# EAGLE board MicroMod_Asset_Tracker (EAGLE 9.6.2), part 1 of 2
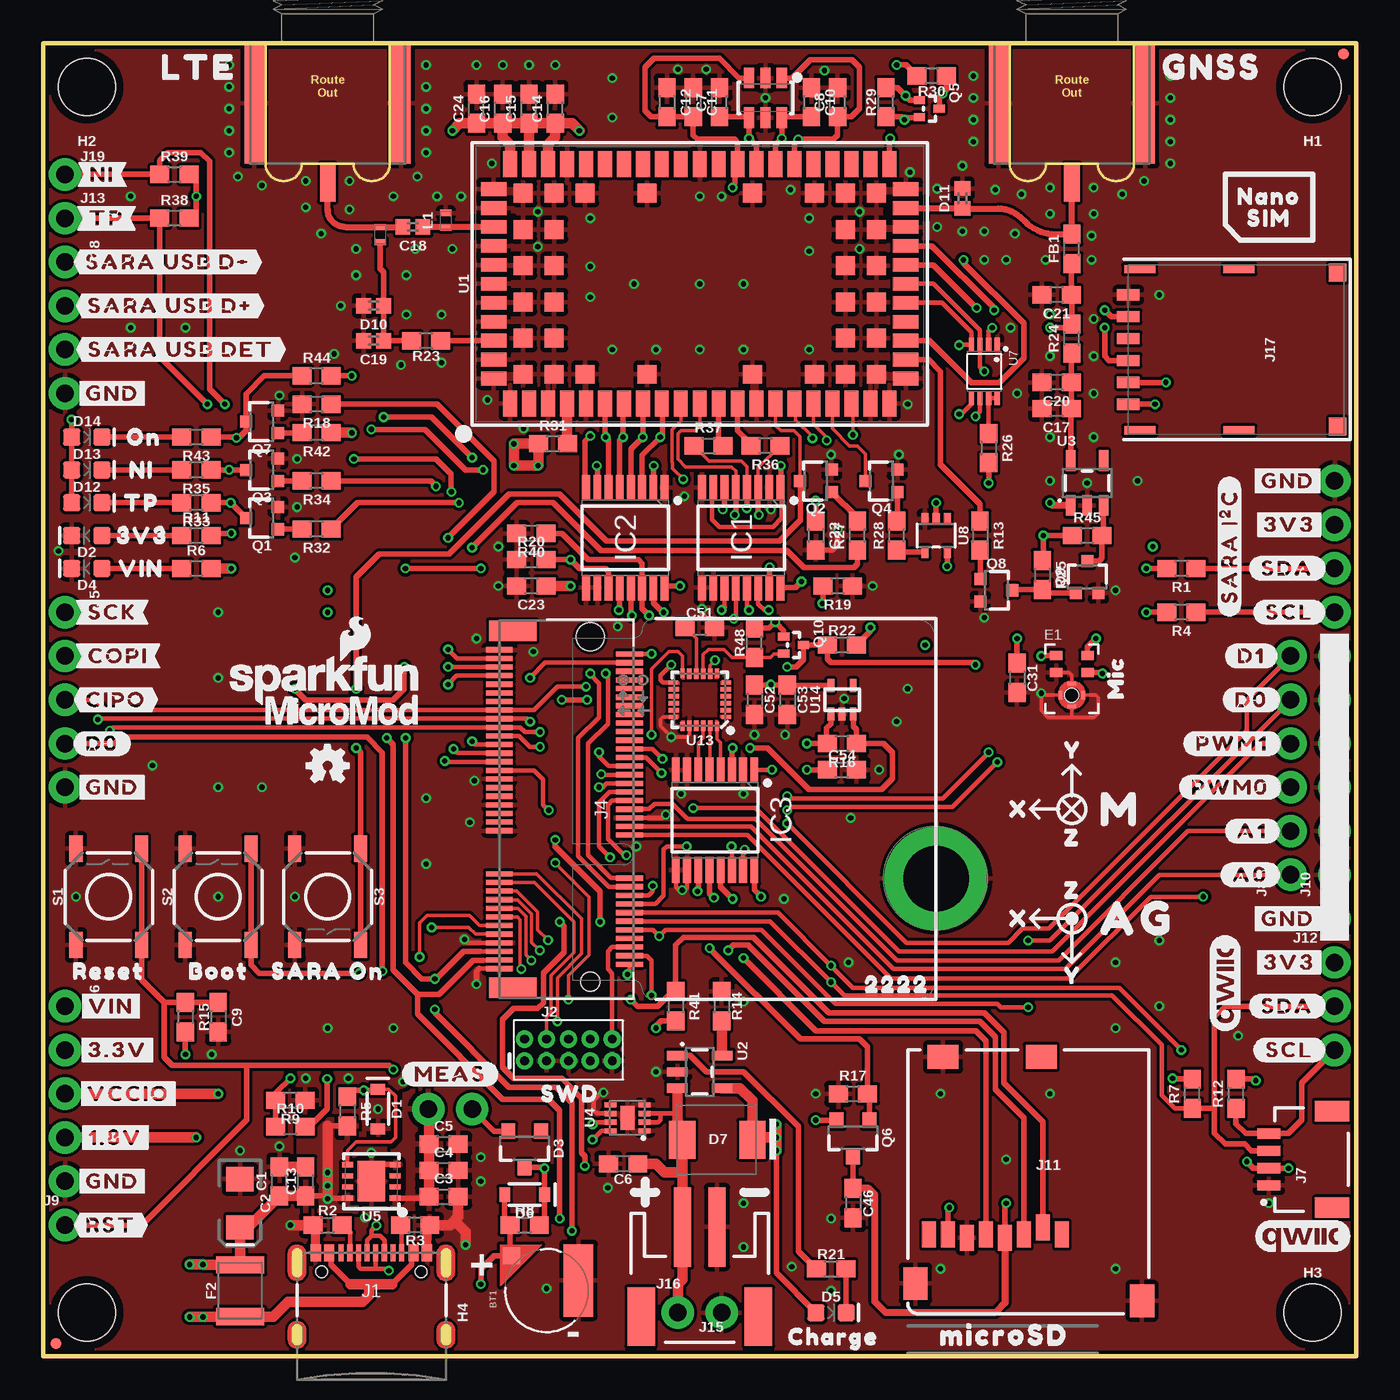
[diagram p2: board, top side]
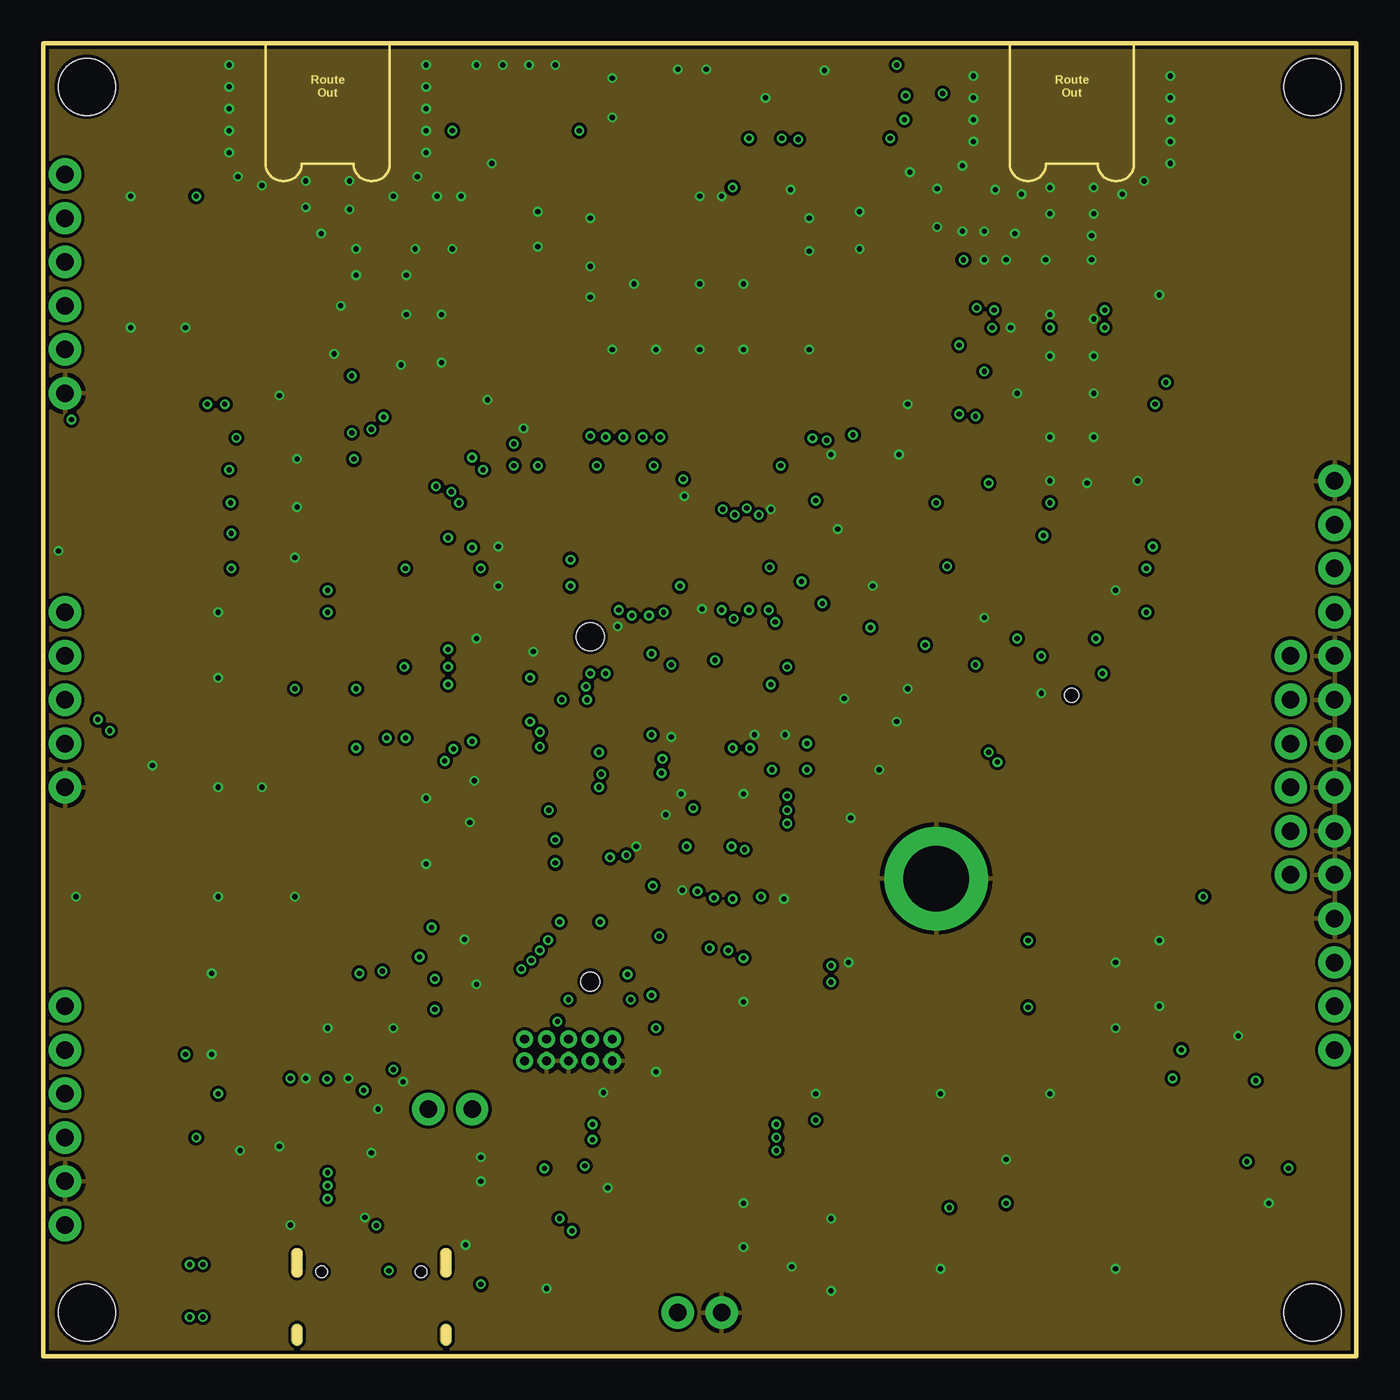
[diagram p3: board, inner layer Route2]
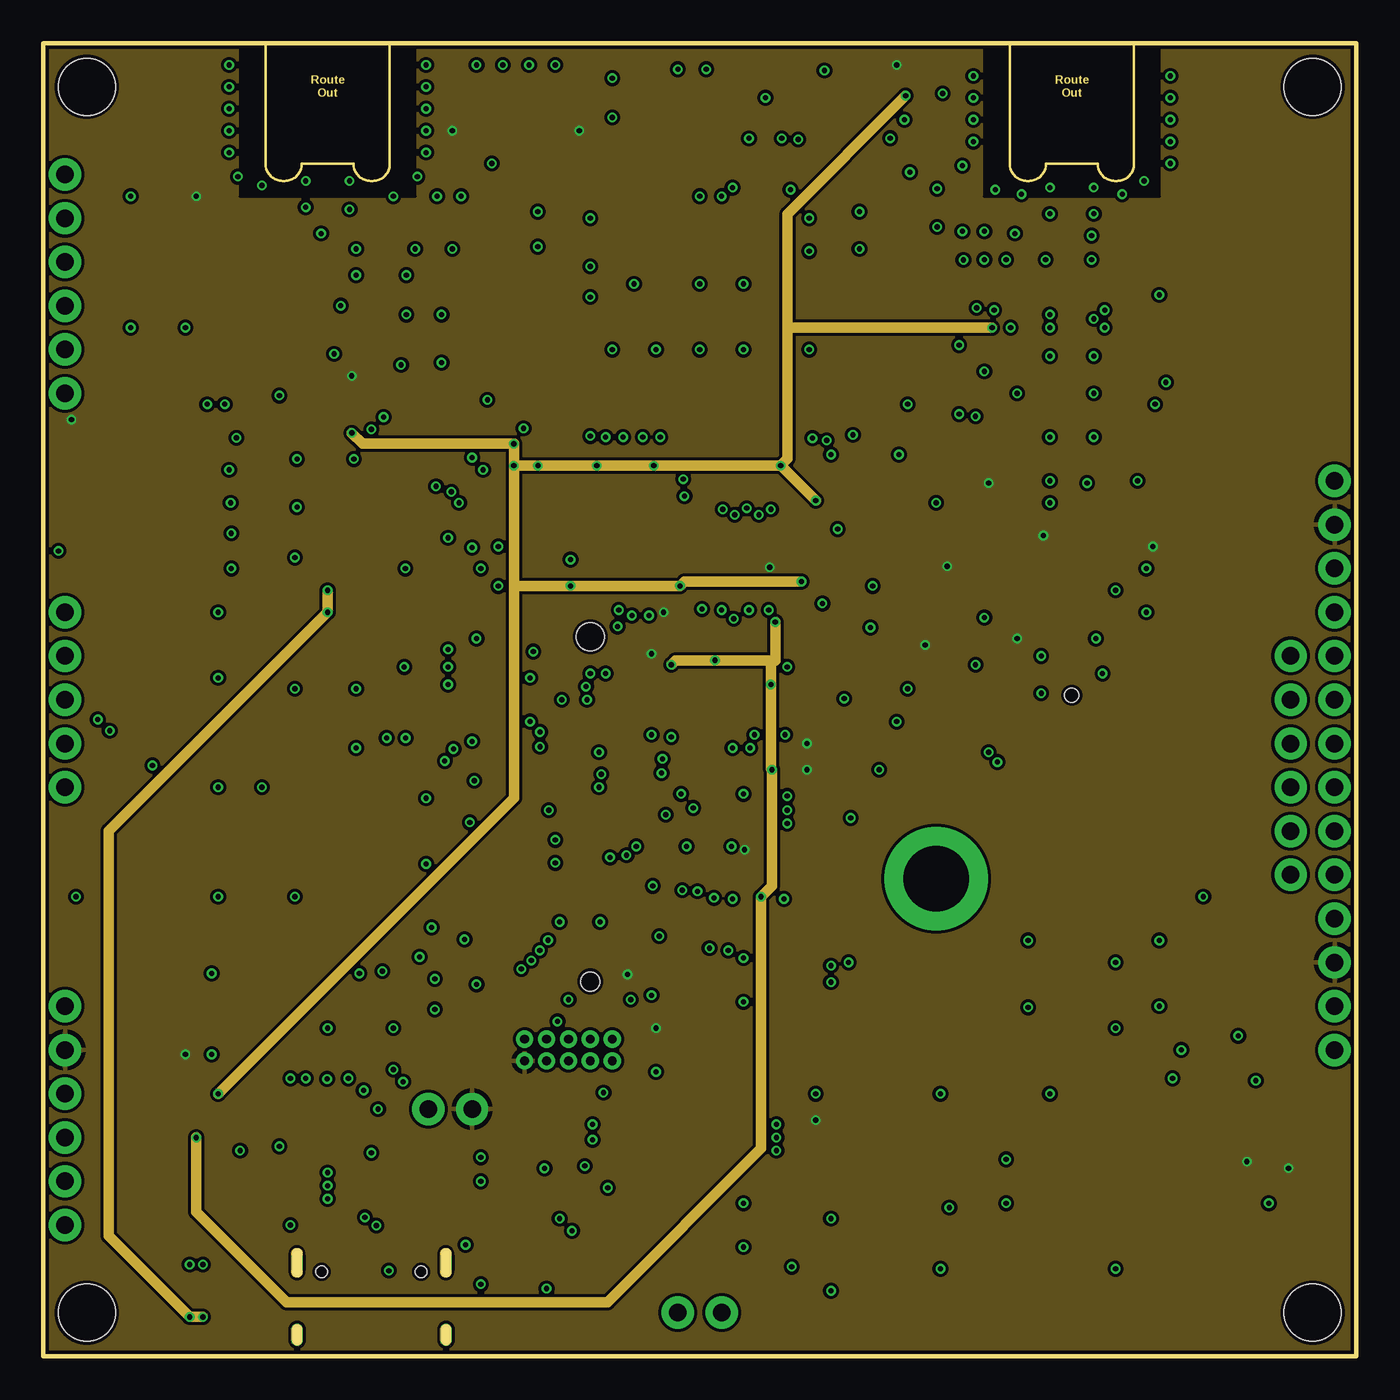
[diagram p4: board, inner layer Route15]
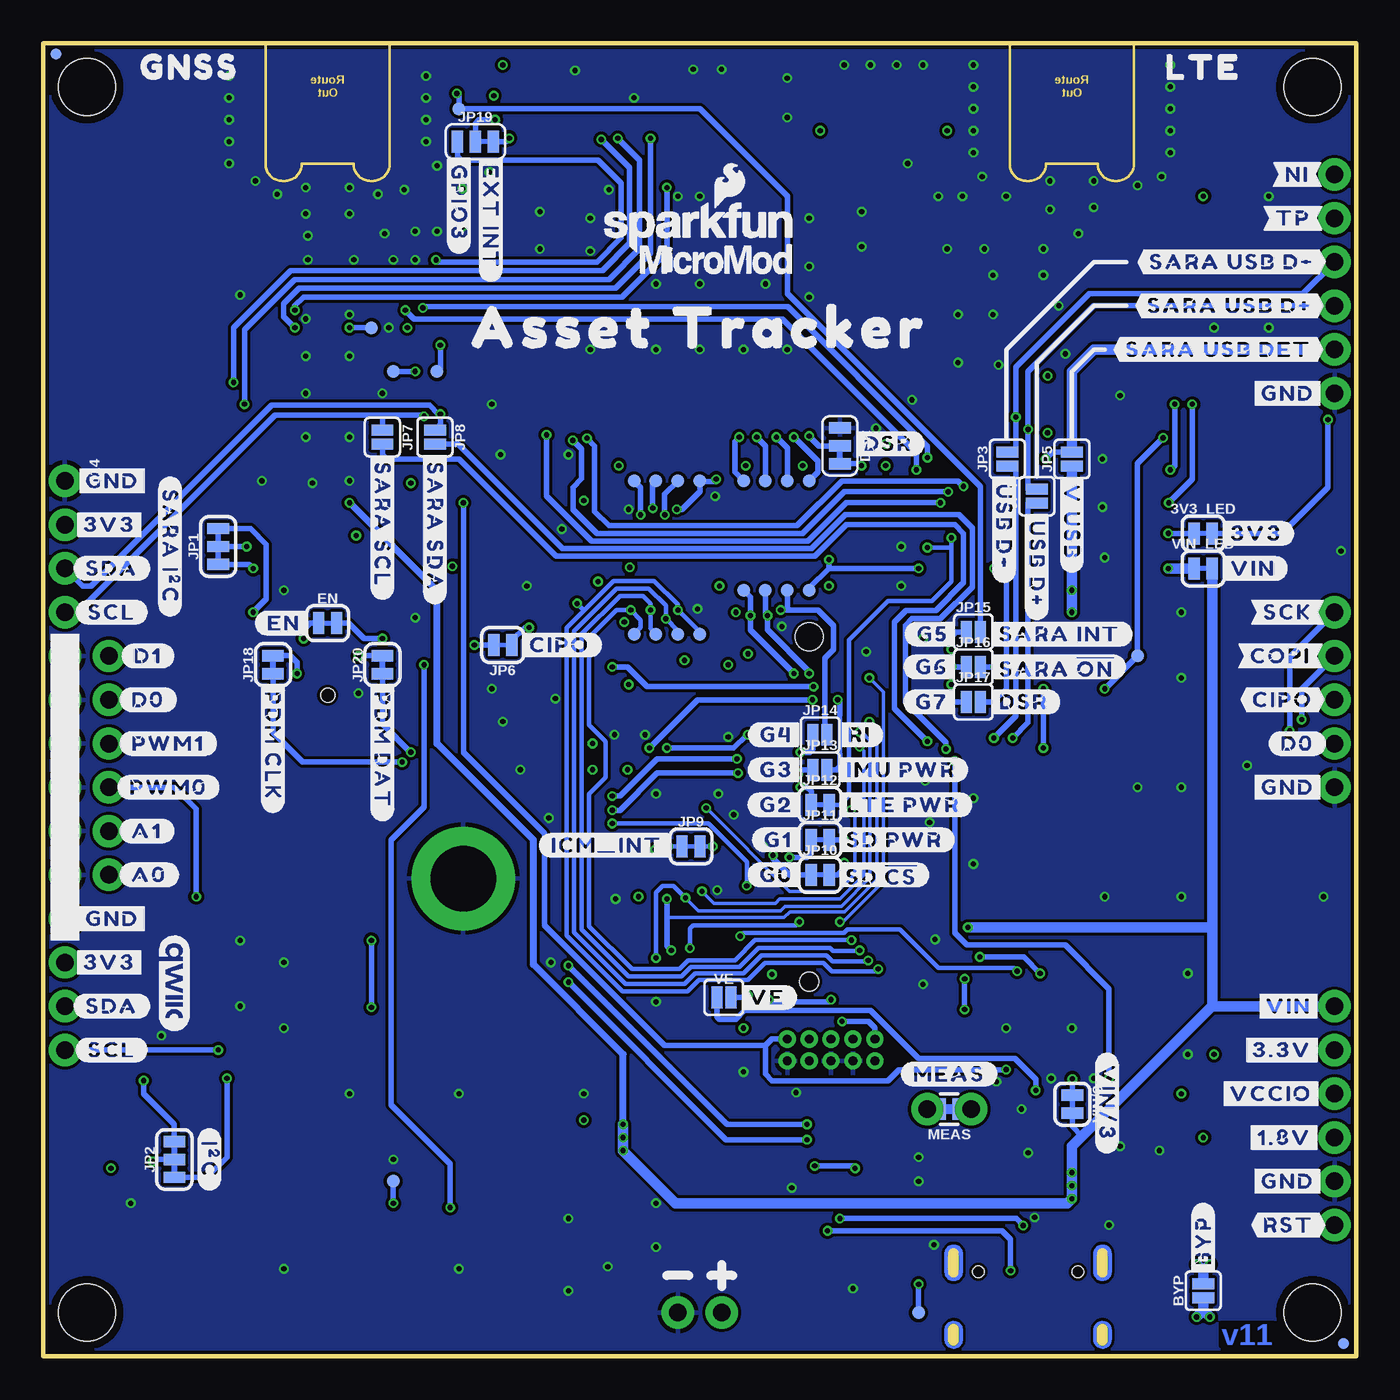
[diagram p5: board, bottom side, seen from below]

Size 76.2 x 76.2 mm. Coordinates in mm from the lower left corner, seen from the top.
Outline: 0,0 0,76.2 76.2,76.2 76.2,0 0,0
Copper layers (1+2*15+16): Top 0.035mm / dielectric 0.2mm / Route2 0.0175mm / dielectric 1.065mm / Route15 0.0175mm / dielectric 0.2mm / Bottom 0.035mm
Design rules "SparkFun-4-layer-1oz-JLCPCB": minimum track width 5mil, minimum drill 0.2mm, track to track 5mil, track to pad 0.2mm, pad to pad 5mil, via to via 0.2mm, smd to smd 0mil, copper to edge 0.2mm, drill to drill 10mil, minimum pad ring 0.13mm, minimum via ring 0.13mm, stop-mask expansion 0.05mm, vias tented up to drill 25mil, thermal gap 10mil
Net classes: 0 default: width 0 mm, drill 0 mm; 1 power: width 0.762 mm

## Footprints (pad centres in the part's own frame; a part is rotated, then mirrored left to right if it is on the bottom)
SMT-JUMPER_2_NC_TRACE_SILK = smd 0.66 x 1.27: 1 -0.521,0; 2 0.521,0
ML414H_IV01E = smd 1 x 1: + 2.022,2.032 | smd 4.2 x 1.7: - 0.6,-1.85
SMT-JUMPER_2_NO_SILK = smd 0.635 x 1.27: 1 -0.406,0; 2 0.406,0
0603 = smd 1.1 x 1: 1 -0.85,0; 2 0.85,0
EIA3216 = smd 1.4 x 1.6: + 1.4,0; - -1.4,0
0402 = smd 0.85 x 0.9: 1 -0.58,0; 2 0.58,0
SOD-323 = smd 0.63 x 0.83: A 1.15,0; C -1.15,0
LED-0603 = smd 1 x 1: A -0.877,0; C 0.877,0
SOT23-3 = smd 0.8 x 0.9: 1 -0.95,-1; 2 0.95,-1; 3 0,1.1
DO-214BA = smd 1.52 x 2.21: A -2.032,0; C 2.038,0
SOT23-6L = smd 0.6 x 1.2: 1 -0.95,-1.15; 2 0,-1.15; 3 0.95,-1.15; 4 0.95,1.15; 5 0,1.15; 6 -0.95,1.15
SMT-JUMPER_3_1-NC_TRACE_SILK = smd 0.66 x 1.27: 1 -1.041,0; 2 0,0; 3 1.041,0
SPH0641LM4H-1_MICROPHONE = smd 0.725 x 0.522: 1 -0.9,1.3; 2 -0.9,0.3; 4 0.9,0.3; 5 0.9,1.3 | smd 0.5 x 0.2: 3 0,-1.65; 8 0,-0.35 | smd 0.2 x 0.5: 6 -0.65,-1; 7 0.65,-1 | hole 0.8: 0,-1
SMA-EDGE-SMD = smd 1.15 x 7: GND@0 -4.25,-3.5; GND@1 4.25,-3.5 | smd 0.9 x 2.2: SIG 0,-8.1
1210 = smd 1 x 2.8: 1 -1.5,0; 2 1.5,0
FIDUCIAL-MICRO = smd 0.635 x 0.635: 1 0,0
STAND-OFF = hole 3.302: 0,0
STAND-OFF-REFLOW-M2.5 = drill 3.8 pad 6: 1 0,0
SOP65P640X120-16N = smd 1.5 x 0.45: 1 -2.9,2.275; 2 -2.9,1.625; 3 -2.9,0.975; 4 -2.9,0.325; 5 -2.9,-0.325; 6 -2.9,-0.975; 7 -2.9,-1.625; 8 -2.9,-2.275; 9 2.9,-2.275; 10 2.9,-1.625; 11 2.9,-0.975; 12 2.9,-0.325; 13 2.9,0.325; 14 2.9,0.975; 15 2.9,1.625; 16 2.9,2.275
USB-C-16P_4LAYER-PADS = smd 0.3 x 1: A5 -1.25,-0.34; A6 -0.25,-0.34; A7 0.25,-0.34; A8 1.25,-0.34; B5 1.75,-0.34; B6 0.75,-0.34; B7 -0.75,-0.34; B8 -1.75,-0.34 | smd 0.6 x 1: GND -3.225,-0.34; GND2 3.225,-0.34; VBUS1 -2.45,-0.34; VBUS2 2.45,-0.34 | drill 0.4 pad 0.6 long: SHLD1 -4.318,-0.915; SHLD2 4.318,-0.915; SHLD3 -4.318,-5.095; SHLD4 4.318,-5.095 | hole 0.65: -2.89,-1.445; 2.89,-1.445
2X5-PTH-1.27MM = drill 0.508 pad 1: 1 -2.54,-0.635; 2 -2.54,0.635; 3 -1.27,-0.635; 4 -1.27,0.635; 5 0,-0.635; 6 0,0.635; 7 1.27,-0.635; 8 1.27,0.635; 9 2.54,-0.635; 10 2.54,0.635
M.2-CONNECTOR-E = smd 0.3 x 1.55: 1 9.25,-5.275; 2 9,2.275; 3 8.75,-5.275; 4 8.5,2.275; 5 8.25,-5.275; 6 8,2.275; 7 7.75,-5.275; 8 7.5,2.275; 9 7.25,-5.275; 10 7,2.275; 11 6.75,-5.275; 12 6.5,2.275; 13 6.25,-5.275; 14 6,2.275; 15 5.75,-5.275; 16 5.5,2.275; 17 5.25,-5.275; 18 5,2.275; 19 4.75,-5.275; 20 4.5,2.275; 21 4.25,-5.275; 22 4,2.275; 23 3.75,-5.275; 32 1.5,2.275; 33 1.25,-5.275; 34 1,2.275; 35 0.75,-5.275; 36 0.5,2.275; 37 0.25,-5.275; 38 0,2.275; 39 -0.25,-5.275; 40 -0.5,2.275; 41 -0.75,-5.275; 42 -1,2.275; 43 -1.25,-5.275; 44 -1.5,2.275; 45 -1.75,-5.275; 46 -2,2.275; 47 -2.25,-5.275; 48 -2.5,2.275; 49 -2.75,-5.275; 50 -3,2.275; 51 -3.25,-5.275; 52 -3.5,2.275; 53 -3.75,-5.275; 54 -4,2.275; 55 -4.25,-5.275; 56 -4.5,2.275; 57 -4.75,-5.275; 58 -5,2.275; 59 -5.25,-5.275; 60 -5.5,2.275; 61 -5.75,-5.275; 62 -6,2.275; 63 -6.25,-5.275; 64 -6.5,2.275; 65 -6.75,-5.275; 66 -7,2.275; 67 -7.25,-5.275; 68 -7.5,2.275; 69 -7.75,-5.275; 70 -8,2.275; 71 -8.25,-5.275; 72 -8.5,2.275; 73 -8.75,-5.275; 74 -9,2.275; 75 -9.25,-5.275 | smd 1.2 x 2.75: A1 10.35,-4.5; A2 -10.35,-4.5 | hole 1.1: 10,0 | hole 1.6: -10,0
1X05_NO_SILK = drill 1.016 pad 1.88: 1 0,0; 2 2.54,0; 3 5.08,0; 4 7.62,0; 5 10.16,0
JST04_1MM_RA = smd 0.6 x 1.35: 1 -1.5,0; 2 -0.5,0; 3 0.5,0; 4 1.5,0 | smd 1.2 x 2: NC1 2.8,-3.675; NC2 -2.8,-3.675
1X06_NO_SILK = drill 1.016 pad 1.88: 1 0,0; 2 2.54,0; 3 5.08,0; 4 7.62,0; 5 10.16,0; 6 12.7,0
1X01_NO_SILK = drill 1.016 pad 1.88: 1 0,0
MICRO-SD-SOCKET = smd 1.8 x 1.4: CD1 -2.05,0.4; CD2 -7.75,0.4 | smd 0.8 x 1.5: CS/DAT3 -7.84,10.3; DAT1 -1.24,10.7; DAT2 -8.94,10.7; DI/CMD -6.74,10.7; DO/DAT0 -2.34,10.7; GND -3.44,10.9; SCLK -4.54,10.7; VCC -5.64,10.9 | smd 1.4 x 1.9: GND1 -13.6,14.55; GND3 -0.45,13.55
1X04_NO_SILK = drill 1.016 pad 1.88: 1 0,0; 2 2.54,0; 3 5.08,0; 4 7.62,0
JST-2-SMD = smd 1 x 4.6: 1 -1,-3.7; 2 1,-3.7 | smd 1.6 x 3.4: NC1 -3.4,1.5; NC2 3.4,1.5
1X02_NO_SILK = drill 1.016 pad 1.88: 1 0,0; 2 2.54,0
NANO_SIM_WURTH_693043020611 = smd 0.65 x 1.3: C1 1.905,6.25; C2 -0.635,6.25; C3 -1.905,6.25; C5 3.175,6.25; C6 0.635,6.25; C7 -3.175,6.25 | smd 0.48 x 1.8: MNT1 -4.69,5.58; MNT2 4.66,5.58; MNT3 -4.69,-0.17; MNT4 4.66,-0.17 | smd 1.03 x 1: MNT5 -4.465,-5.89; MNT6 4.465,-5.89
SMT-JUMPER_3_2-NC_TRACE_SILK = smd 0.66 x 1.27: 1 -1.041,0; 2 0,0; 3 1.041,0
0402_COILCRAFT = smd 0.356 x 0.66: P$1 -0.432,0; P$2 0.432,0
COMBO-JUMPER_2_NC_TRACE = smd 0.635 x 1.27: 1 -0.508,0; 2 0.508,0 | drill 1.016 pad 1.88: 3 -1.27,0; 4 1.27,0
SOT323 = smd 0.7 x 0.7: 1 -0.65,-0.925; 2 0.65,-0.925; 3 0,0.925
SOT-416FL = smd 0.46 x 0.65: 1 -0.5,-1.1; 2 0.5,-1.1; 3 0,0.05
TACTILE_SWITCH_SMD_5.2MM = smd 1.524 x 0.762: 1 -2.794,1.905; 2 2.794,1.905; 3 -2.794,-1.905; 4 2.794,-1.905
PAD.03X.03 = smd 0.762 x 0.762: P$1 0,0
SARA-LGA = smd 0.8 x 1.5: 1 -11,-6.95; 2 -9.9,-6.95; 3 -8.8,-6.95; 4 -7.7,-6.95; 5 -6.6,-6.95; 6 -5.5,-6.95; 7 -4.4,-6.95; 8 -3.3,-6.95; 9 -2.2,-6.95; 10 -1.1,-6.95; 11 0,-6.95; 12 1.1,-6.95; 13 2.2,-6.95; 14 3.3,-6.95; 15 4.4,-6.95; 16 5.5,-6.95; 17 6.6,-6.95; 18 7.7,-6.95; 19 8.8,-6.95; 20 9.9,-6.95; 21 11,-6.95; 33 11,6.95; 34 9.9,6.95; 35 8.8,6.95; 36 7.7,6.95; 37 6.6,6.95; 38 5.5,6.95; 39 4.4,6.95; 40 3.3,6.95; 41 2.2,6.95; 42 1.1,6.95; 43 0,6.95; 44 -1.1,6.95; 45 -2.2,6.95; 46 -3.3,6.95; 47 -4.4,6.95; 48 -5.5,6.95; 49 -6.6,6.95; 50 -7.7,6.95; 51 -8.8,6.95; 52 -9.9,6.95; 53 -11,6.95 | smd 1.5 x 0.8: 22 11.95,-5.5; 23 11.95,-4.4; 24 11.95,-3.3; 25 11.95,-2.2; 26 11.95,-1.1; 27 11.95,0; 28 11.95,1.1; 29 11.95,2.2; 30 11.95,3.3; 31 11.95,4.4; 32 11.95,5.5; 54 -11.95,5.5; 55 -11.95,4.4; 56 -11.95,3.3; 57 -11.95,2.2; 58 -11.95,1.1; 59 -11.95,0; 60 -11.95,-1.1; 61 -11.95,-2.2; 62 -11.95,-3.3; 63 -11.95,-4.4; 64 -11.95,-5.5 | smd 1.1 x 1.1: 65 -10.25,-5.25; 66 -10.25,-3.15; 67 -10.25,-1.05; 68 -10.25,1.05; 69 -10.25,3.15; 70 -10.25,5.25; 71 -8.45,-5.25; 72 -8.45,-3.15; 73 -8.45,-1.05; 74 -8.45,1.05; 75 -8.45,3.15; 76 -8.45,5.25; 77 -6.65,-5.25; 78 -6.65,5.25; 79 -3.05,-5.25; 80 -3.05,5.25; 81 3.05,-5.25; 82 3.05,5.25; 83 6.65,-5.25; 84 6.65,5.25; 85 8.45,-5.25; 86 8.45,-3.15; 87 8.45,-1.05; 88 8.45,1.05; 89 8.45,3.15; 90 8.45,5.25; 91 10.25,-5.25; 92 10.25,-3.15; 93 10.25,-1.05; 94 10.25,1.05; 95 10.25,3.15; 96 10.25,5.25
SOT23-5 = smd 0.55 x 1.2: 1 -0.95,-1.3; 2 0,-1.3; 3 0.95,-1.3; 4 0.95,1.3; 5 -0.95,1.3
DFN-8 = smd 0.3 x 0.7: 1 -0.75,-0.99; 2 -0.25,-0.99; 3 0.25,-0.99; 4 0.75,-0.99; 5 0.75,0.99; 6 0.25,0.99; 7 -0.25,0.99; 8 -0.75,0.99 | smd 1.38 x 0.8: 9 0,0
UDFN-8 = smd 0.3 x 0.65: 1 -0.975,-1.375; 2 -0.325,-1.375; 3 0.325,-1.375; 4 0.975,-1.375; 5 0.975,1.375; 6 0.325,1.375; 7 -0.325,1.375; 8 -0.975,1.375 | smd 2.35 x 1.6: EP 0,0
VSSOP_8PIN = smd 0.8 x 0.3: P1 -1.55,0.75; P2 -1.55,0.25; P3 -1.55,-0.25; P4 -1.55,-0.75; P5 1.55,-0.75; P6 1.55,-0.25; P7 1.55,0.25; P8 1.55,0.75
SOT353 = smd 0.42 x 0.7: 1 -0.65,-0.95; 2 0,-0.95; 3 0.65,-0.95; 4 0.65,0.95; 5 -0.65,0.95
QFN24-3X3-ICM-20948 = smd 0.495 x 0.25: 1 -1.552,1; 6 -1.552,-1; 13 1.552,-1; 18 1.552,1 | smd 0.6 x 0.25: 2 -1.5,0.6; 3 -1.5,0.2; 4 -1.5,-0.2; 5 -1.5,-0.6; 14 1.5,-0.6; 15 1.5,-0.2; 16 1.5,0.2; 17 1.5,0.6 | smd 0.25 x 0.495: 7 -1,-1.552; 12 1,-1.552; 19 1,1.552; 24 -1,1.552 | smd 0.25 x 0.6: 8 -0.6,-1.5; 9 -0.2,-1.5; 10 0.2,-1.5; 11 0.6,-1.5; 20 0.6,1.5; 21 0.2,1.5; 22 -0.2,1.5; 23 -0.6,1.5
SC70 = smd 0.4 x 0.75: 1 -0.65,-0.825; 2 0,-0.825; 3 0.65,-0.825; 4 0.65,0.825; 5 -0.65,0.825

## Placement (x,y rotation side)
3V3_LED  [SMT-JUMPER_2_NC_TRACE_SILK]  8.89,47.75 0 bottom
BT1  ML414H  [ML414H_IV01E]  29.21,3.81 90 top
BYP  JUMPER-SMT_2_NO_SILK  [SMT-JUMPER_2_NO_SILK]  8.89,3.81 90 bottom
C1  0.1uF  [0603]  13.72,10.16 90 top
C2  10uF  [EIA3216]  11.43,8.89 270 top
C3  4.7uF  [0603]  23.24,9.27 0 top
C4  0.1uF  [0603]  23.24,10.79 0 top
C5  0.22uF  [0603]  23.24,12.32 0 top
C6  4.7uF  [0603]  33.66,11.18 180 top
C7  47pF  [0603]  39.24,72.77 90 top
C8  47pF  [0603]  46.1,72.77 90 top
C9  1nF  [0603]  10.16,19.68 270 top
C10  47pF  [0603]  44.58,72.77 270 top
C11  47pF  [0603]  37.72,72.77 270 top
C12  0.1uF  [0603]  36.2,72.77 270 top
C13  0.22uF  [0603]  15.24,10.16 90 top
C14  0.1uF  [0603]  29.72,72.39 90 top
C15  68pF  [0603]  28.19,72.39 90 top
C16  10uF  [0603]  26.67,72.39 90 top
C17  1.0uF  [0603]  58.8,54.99 180 top
C18  33pF  [0402]  21.46,65.53 180 top
C19  27pF  [0402]  19.18,58.93 180 top
C20  0.1uF  [0603]  58.8,56.52 180 top
C21  47pF  [0603]  58.8,61.59 180 top
C22  0.1uF  [0603]  44.83,47.62 270 top
C23  0.1uF  [0603]  28.32,44.7 180 top
C24  15pF  [0603]  25.15,72.39 90 top
C31  0.1uF  [0603]  56.52,39.37 270 top
C46  0.1uF  [0603]  46.99,8.89 270 top
C51  0.1uF  [0603]  38.1,42.29 0 top
C52  0.1uF  [0603]  41.27,38.1 270 top
C53  1.0uF  [0603]  43.18,38.1 270 top
C54  1.0uF  [0603]  46.35,34.04 0 top
D1  3.3V  [SOD-323]  19.43,14.35 270 top
D2  RED  [LED-0603]  2.54,47.62 180 top
D3  BAS70-05  [SOT23-3]  27.94,12.06 180 top
D4  Yellow  [LED-0603]  2.54,45.72 180 top
D5  Yellow  [LED-0603]  45.72,2.54 0 top
D6  3A/10V/280mV  [SOD-323]  27.94,9.4 180 top
D7  1A/15V/220mV  [DO-214BA]  39.12,12.57 0 top
D8  DT1042-04SO-7  [SOT23-6L]  41.91,73.03 180 top
D10  PESD0402  [0402]  19.18,60.96 180 top
D11  PESD0402  [0402]  53.34,67.18 90 top
D12  GREEN  [LED-0603]  2.54,49.53 0 top
D13  BLUE  [LED-0603]  2.54,51.44 0 top
D14  WHITE  [LED-0603]  2.54,53.34 0 top
DSR  JUMPER-SMT_3_1-NC_TRACE_SILK  [SMT-JUMPER_3_1-NC_TRACE_SILK]  29.97,52.83 270 bottom
E1  SPH0641LM4H-1  [SPH0641LM4H-1_MICROPHONE]  59.69,39.37 0 top
E3  ANTENNA-SMA-GROUNDEDEDGE_SMA_SMD  [SMA-EDGE-SMD]  16.51,76.2 0 top
E4  ANTENNA-SMA-GROUNDEDEDGE_SMA_SMD  [SMA-EDGE-SMD]  59.69,76.2 0 top
EN  [SMT-JUMPER_2_NC_TRACE_SILK]  59.69,42.55 0 bottom
F2  6V/2A  [1210]  11.43,3.81 90 top
FB1  30Ω/1.8A  [0603]  59.69,64.26 90 top
FD1  FIDUCIALUFIDUCIAL  [FIDUCIAL-MICRO]  0.76,0.76 0 top
FD2  FIDUCIALUFIDUCIAL  [FIDUCIAL-MICRO]  75.44,75.56 0 top
FD3  FIDUCIALUFIDUCIAL  [FIDUCIAL-MICRO]  0.76,0.76 0 bottom
FD4  FIDUCIALUFIDUCIAL  [FIDUCIAL-MICRO]  75.44,75.56 0 bottom
FRAME1  FRAME-LEDGER  [CREATIVE_COMMONS]  106.68,53.34 0 top  (outside the outline)
FRAME2  FRAME-LEDGER  [CREATIVE_COMMONS]  106.68,53.34 0 top  (outside the outline)
H1  STAND-OFF  [STAND-OFF]  73.66,73.66 0 top
H2  STAND-OFF  [STAND-OFF]  2.54,73.66 0 top
H3  STAND-OFF  [STAND-OFF]  73.66,2.54 0 top
H4  STAND-OFF  [STAND-OFF]  2.54,2.54 0 top
H5  STAND-OFF-REFLOW2.5MM_TALL  [STAND-OFF-REFLOW-M2.5]  51.82,27.73 0 top
IC1  SN74AVC4T774PW  [SOP65P640X120-16N]  40.51,47.5 270 top
IC2  SN74AVC4T774PW  [SOP65P640X120-16N]  33.78,47.5 270 top
IC3  SN74AVC4T774PW  [SOP65P640X120-16N]  38.99,31.11 270 top
J1  [USB-C-16P_4LAYER-PADS]  19.05,6.35 0 top
J2  JTAG  [2X5-PTH-1.27MM]  30.48,17.78 0 top
J4  MICROMOD-2222-C  [M.2-CONNECTOR-E]  31.75,31.75 270 top
J5  SPI  [1X05_NO_SILK]  1.27,43.18 270 top
J6  DIAG  [1X05_NO_SILK]  1.27,20.32 270 top
J7  QWIIC_RIGHT_ANGLE  [JST04_1MM_RA]  71.12,11.43 90 top
J8  [1X06_NO_SILK]  72.39,27.94 90 top
J9  !RST!  [1X01_NO_SILK]  1.27,7.62 0 top
J10  [1X06_NO_SILK]  74.93,27.94 90 top
J11  microSD  [MICRO-SD-SOCKET]  50.16,17.78 180 top
J12  [1X04_NO_SILK]  74.93,25.4 270 top
J13  TP  [1X01_NO_SILK]  1.27,66.04 0 top
J14  [1X04_NO_SILK]  74.93,50.8 270 bottom
J15  [JST-2-SMD]  38.1,3.81 180 top
J16  [1X02_NO_SILK]  36.83,2.54 0 top
J17  NANO_SIM  [NANO_SIM_WURTH_693043020611]  69.22,58.42 90 top
J18  SARA_USB  [1X04_NO_SILK]  1.27,63.5 270 top
J19  NI  [1X01_NO_SILK]  1.27,68.58 0 top
JP1  [SMT-JUMPER_3_2-NC_TRACE_SILK]  66.04,46.99 90 bottom
JP2  [SMT-JUMPER_3_2-NC_TRACE_SILK]  68.58,11.43 90 bottom
JP3  JUMPER-SMT_2_NO_SILK  [SMT-JUMPER_2_NO_SILK]  20.26,52.07 90 bottom
JP4  JUMPER-SMT_2_NO_SILK  [SMT-JUMPER_2_NO_SILK]  18.54,49.91 90 bottom
JP5  JUMPER-SMT_2_NO_SILK  [SMT-JUMPER_2_NO_SILK]  16.51,52.07 90 bottom
JP6  JUMPER-SMT_2_NC_TRACE_SILK  [SMT-JUMPER_2_NC_TRACE_SILK]  49.53,41.27 180 bottom
JP7  JUMPER-SMT_2_NO_SILK  [SMT-JUMPER_2_NO_SILK]  56.52,53.34 270 bottom
JP8  JUMPER-SMT_2_NO_SILK  [SMT-JUMPER_2_NO_SILK]  53.47,53.34 270 bottom
JP9  JUMPER-SMT_2_NC_TRACE_SILK  [SMT-JUMPER_2_NC_TRACE_SILK]  38.61,29.59 0 bottom
JP10  JUMPER-SMT_2_NC_TRACE_SILK  [SMT-JUMPER_2_NC_TRACE_SILK]  31.11,27.94 0 bottom
JP11  JUMPER-SMT_2_NC_TRACE_SILK  [SMT-JUMPER_2_NC_TRACE_SILK]  31.11,29.97 0 bottom
JP12  JUMPER-SMT_2_NC_TRACE_SILK  [SMT-JUMPER_2_NC_TRACE_SILK]  31.11,32 0 bottom
JP13  JUMPER-SMT_2_NO_SILK  [SMT-JUMPER_2_NO_SILK]  31.11,34.04 0 bottom
JP14  JUMPER-SMT_2_NO_SILK  [SMT-JUMPER_2_NO_SILK]  31.11,36.07 0 bottom
JP15  JUMPER-SMT_2_NO_SILK  [SMT-JUMPER_2_NO_SILK]  22.23,42.04 0 bottom
JP16  JUMPER-SMT_2_NO_SILK  [SMT-JUMPER_2_NO_SILK]  22.23,40.01 0 bottom
JP17  JUMPER-SMT_2_NO_SILK  [SMT-JUMPER_2_NO_SILK]  22.23,37.97 0 bottom
JP18  JUMPER-SMT_2_NC_TRACE_SILK  [SMT-JUMPER_2_NC_TRACE_SILK]  62.87,40.13 90 bottom
JP19  JUMPER-SMT_3_1-NC_TRACE_SILK  [SMT-JUMPER_3_1-NC_TRACE_SILK]  51.12,70.48 0 bottom
JP20  JUMPER-SMT_2_NC_TRACE_SILK  [SMT-JUMPER_2_NC_TRACE_SILK]  56.52,40.13 90 bottom
L1  DNP  [0402_COILCRAFT]  23.37,65.91 90 top
L2  68nH  [0402_COILCRAFT]  19.56,65.09 90 top
LOGO1  SFE_LOGO_NAME_FLAME.1_INCH  [SFE_LOGO_NAME_FLAME_.1]  16.38,39.24 0 top
LOGO2  QWIIC_LOGO_CONNECTOR  [QWIIC_5.5MM]  73.09,6.99 0 top
LOGO3  OSHW-LOGOMINI  [OSHW-LOGO-MINI]  16.51,34.29 0 top
LOGO4  SFE_LOGO_NAME_FLAME.1_INCH  [SFE_LOGO_NAME_FLAME_.1]  38.1,65.53 0 bottom
LOGO5  SPECIAL_INSTRUCTIONS-ORDERING  [ORDERING_INSTRUCTIONS]  80.01,50.8 0 top  (outside the outline)
LOGO6  QWIIC_LOGO_CONNECTOR  [QWIIC_5.5MM]  68.58,21.65 90 top
LOGO7  QWIIC_LOGO_CONNECTOR  [QWIIC_5.5MM]  68.58,21.65 270 bottom
MEAS  [COMBO-JUMPER_2_NC_TRACE]  23.62,14.35 180 bottom
Q1  310mA/60V/1.6Ω  [SOT323]  12.7,48.64 90 top
Q2  310mA/60V/1.6Ω  [SOT323]  44.83,50.8 90 top
Q3  310mA/60V/1.6Ω  [SOT323]  12.7,51.44 90 top
Q4  310mA/60V/1.6Ω  [SOT323]  48.64,50.8 90 top
Q5  20V/0.2A/8MHz/1.2Ω/1Vth  [SOT-416FL]  51.94,72.39 270 top
Q6  20V/4.2A/52mΩ/1.4W  [SOT23-3]  46.99,12.7 180 top
Q7  310mA/60V/1.6Ω  [SOT323]  12.7,54.23 90 top
Q8  310mA/60V/1.6Ω  [SOT323]  55.31,44.45 270 top
Q9  310mA/60V/1.6Ω  [SOT323]  60.58,45.21 0 top
Q10  20V/0.2A/8MHz/1.2Ω/1Vth  [SOT-416FL]  44.07,41.27 270 top
R1  2.2k  [0603]  66.04,45.72 180 top
R2  5.1k  [0603]  16.51,7.62 0 top
R3  5.1k  [0603]  21.59,7.62 180 top
R4  2.2k  [0603]  66.04,43.18 180 top
R5  100k  [0603]  17.65,14.22 270 top
R6  4.7k  [0603]  8.89,45.72 0 top
R7  2.2k  [0603]  66.67,15.24 90 top
R8  3.3k  [0603]  27.94,7.62 0 top
R9  10k  [0603]  14.35,14.86 180 top
R10  20k  [0603]  14.35,13.34 0 top
R11  1k  [0603]  8.89,47.62 0 top
R12  2.2k  [0603]  69.22,15.24 90 top
R13  1k  [0603]  54.36,47.62 270 top
R14  2.2k  [0603]  39.37,20.32 270 top
R15  100k  [0603]  8.26,19.68 270 top
R16  100k  [0603]  46.35,35.56 180 top
R17  100k  [0603]  46.99,15.24 0 top
R18  100k  [0603]  15.88,55.24 180 top
R19  100k  [0603]  46.1,44.7 180 top
R20  100k  [0603]  28.32,46.23 0 top
R21  1k  [0603]  45.72,5.08 0 top
R22  2.2k  [0603]  46.35,41.27 0 top
R23  10k  [0603]  22.23,58.93 180 top
R24  10  [0603]  59.69,59.05 90 top
R25  100k  [0603]  57.98,45.34 270 top
R26  200k  [0603]  54.86,52.7 270 top
R27  1k  [0603]  47.24,47.62 90 top
R28  1k  [0603]  49.53,47.62 90 top
R29  2.2k  [0603]  48.9,72.77 90 top
R30  2.2k  [0603]  51.56,74.3 180 top
R31  0  [0603]  29.59,52.96 0 top
R32  1k  [0603]  15.88,48.01 180 top
R33  100  [0603]  8.89,49.53 180 top
R34  1k  [0603]  15.88,50.8 180 top
R35  470  [0603]  8.89,51.44 180 top
R36  0  [0603]  41.91,52.83 180 top
R37  0  [0603]  38.61,52.83 0 top
R38  100k  [0603]  7.62,66.04 0 top
R39  100k  [0603]  7.62,68.58 0 top
R40  100k  [0603]  28.32,47.75 180 top
R41  100k  [0603]  36.7,20.32 270 top
R42  1k  [0603]  15.88,53.59 180 top
R43  1k  [0603]  8.89,53.34 180 top
R44  100k  [0603]  15.88,56.9 0 top
R45  100k  [0603]  60.58,47.62 0 top
R48  2.2k  [0603]  41.27,41.4 90 top
S1  RESET  [TACTILE_SWITCH_SMD_5.2MM]  3.81,26.67 90 top
S2  BOOT  [TACTILE_SWITCH_SMD_5.2MM]  10.16,26.67 90 top
S3  SARA_PWR  [TACTILE_SWITCH_SMD_5.2MM]  16.51,26.67 270 top
TP1  TEST-POINT3  [PAD.03X.03]  41.91,50.8 0 bottom
TP2  TEST-POINT3  [PAD.03X.03]  40.64,50.8 0 bottom
TP3  TEST-POINT3  [PAD.03X.03]  39.37,50.8 0 bottom
TP4  TEST-POINT3  [PAD.03X.03]  38.1,50.8 0 bottom
TP5  TEST-POINT3  [PAD.03X.03]  41.91,41.91 0 bottom
TP6  TEST-POINT3  [PAD.03X.03]  40.64,41.91 0 bottom
TP7  TEST-POINT3  [PAD.03X.03]  39.37,41.91 0 bottom
TP8  TEST-POINT3  [PAD.03X.03]  38.1,41.91 0 bottom
TP9  TEST-POINT3  [PAD.03X.03]  53.34,57.15 0 bottom
TP10  TEST-POINT3  [PAD.03X.03]  55.88,57.15 0 bottom
TP12  TEST-POINT3  [PAD.03X.03]  52.07,72.39 0 bottom
TP13  TEST-POINT3  [PAD.03X.03]  12.7,40.64 0 bottom
TP14  TEST-POINT3  [PAD.03X.03]  35.56,50.8 0 bottom
TP15  TEST-POINT3  [PAD.03X.03]  34.29,50.8 0 bottom
TP16  TEST-POINT3  [PAD.03X.03]  33.02,50.8 0 bottom
TP17  TEST-POINT3  [PAD.03X.03]  31.75,50.8 0 bottom
TP18  TEST-POINT3  [PAD.03X.03]  35.56,44.45 0 bottom
TP19  TEST-POINT3  [PAD.03X.03]  34.29,44.45 0 bottom
TP20  TEST-POINT3  [PAD.03X.03]  33.02,44.45 0 bottom
TP21  TEST-POINT3  [PAD.03X.03]  31.75,44.45 0 bottom
TP22  TEST-POINT3  [PAD.03X.03]  57.15,59.69 0 bottom
TP23  TEST-POINT3  [PAD.03X.03]  55.88,10.16 0 bottom
TP24  TEST-POINT3  [PAD.03X.03]  25.4,2.54 0 bottom
U1  SARA-R510M8S  [SARA-LGA]  38.1,62.23 0 top
U2  MCP73831  [SOT23-5]  38.1,16.51 270 top
U3  3.3V  [SOT23-5]  60.58,50.67 0 top
U4  MAX17048  [DFN-8]  33.91,13.84 90 top
U5  AP7361C-33FGE  [UDFN-8]  19.05,10.16 90 top
U7  PCA9306  [VSSOP_8PIN]  54.61,57.15 270 top
U8  74HC1G04  [SOT353]  51.82,47.62 180 top
U13  9DoF IMU  [QFN24-3X3-ICM-20948]  38.1,38.1 180 top
U14  1.8V/100mA  [SC70]  46.35,38.1 0 top
U$1  [#EN#0]  62.23,42.55 0 bottom
U$2  [MIC0]  62.23,39.37 90 top
U$3  [#3V3#1]  70.1,48.26 0 top
U$4  [#3V3#0]  8,47.75 0 bottom
U$5  [#SARA_I�C#0]  68.83,46.99 90 top
U$6  [#A0#5]  68.33,27.94 0 top
U$7  [#A0#5]  71.75,27.94 0 bottom
U$8  [#A1#4]  68.58,30.48 0 top
U$9  [#A1#4]  71.75,30.48 0 bottom
U$10  [#D0#1]  71.75,38.1 0 bottom
U$11  [#3V3#1]  74.55,48.26 0 bottom
U$12  [#GND#0]  69.98,50.8 0 top
U$13  [#3V3#1]  70.1,22.86 0 top
U$14  [#3V3#1]  74.55,22.86 0 bottom
U$15  [#GND#0]  69.98,25.4 0 top
U$16  [#GND#0]  74.42,25.4 0 bottom
U$17  [#RST#1]  1.78,7.62 0 top
U$18  [#VE#0]  35.94,20.83 0 bottom
U$19  [#MEAS#2]  20.83,16.38 0 top
U$20  [#VIN#1]  8,45.72 0 bottom
U$21  [SWD0]  28.19,15.24 0 top
U$22  [#GND#0]  74.42,50.8 0 bottom
U$23  [#SARA_I�C#0]  68.83,46.99 270 bottom
U$24  [MICROMOD_LOGO_.35]  17.27,37.47 0 top
U$25  [#D0#1]  68.45,38.1 0 top
U$26  [#SCL#3]  70.23,43.18 0 top
U$27  [#SCL#3]  74.3,43.18 0 bottom
U$28  [MICROSD0]  51.15,1.24 0 top
U$29  [#D1#0]  68.58,40.64 0 top
U$30  [#SDA#2]  69.98,45.72 0 top
U$31  [#D1#0]  71.63,40.64 0 bottom
U$32  [#PWM0#3]  65.91,33.02 0 top
U$33  [#BYP#1]  8.89,4.57 90 bottom
U$34  [MICROMOD_LOGO_.35]  37.21,63.63 0 bottom
U$35  [#D0#1]  1.78,35.56 0 top
U$36  [3V37]  3.56,47.62 0 top
U$37  [#SDA#2]  74.42,45.72 0 bottom
U$38  [Y2]  58.55,35.18 0 top
U$39  [X1]  55.37,31.75 0 top
U$40  [BOOT5]  7.75,22.35 0 top
U$41  [#PWM0#3]  71.88,33.02 0 bottom
U$42  [#PWM1#2]  66.17,35.56 0 top
U$43  [#SCL#3]  70.23,17.78 0 top
U$44  [#SCL#3]  74.3,17.78 0 bottom
U$45  [RESET6]  1.02,22.35 0 top
U$46  [VIN8]  3.68,45.72 0 top
U$47  [X1]  55.37,25.4 0 top
U$48  [Y2]  58.55,22.1 0 top
U$49  [#PWM1#2]  71.75,35.56 0 bottom
U$50  [#SDA#2]  69.98,20.32 0 top
U$51  [#SDA#2]  74.42,20.32 0 bottom
U$52  [Z0]  58.55,27.05 0 top
U$53  [#I�C#0]  66.55,13.21 270 bottom
U$54  [Z0]  58.55,30.1 0 top
U$55  [#GND#4]  6.22,55.88 0 bottom
U$56  [#GND#4]  1.78,55.88 0 top
U$57  [#TP#0]  3.68,66.04 0 top
U$58  [#TP#0]  3.68,66.04 0 bottom
U$59  [#NI#0]  3.43,68.58 0 top
U$60  [#NI#0]  3.43,68.58 0 bottom
U$61  [#SARA_USB_D##0]  7.24,63.5 0 top
U$62  [#SARA_USB_D##0]  7.24,63.5 0 bottom
U$63  [#SARA_USB_D##0]  7.37,60.96 0 top
U$64  [#SARA_USB_D##0]  7.37,60.96 0 bottom
U$65  [#SARA_USB_DET#0]  8,58.42 0 top
U$66  [#SARA_USB_DET#0]  8,58.42 0 bottom
U$67  [#VIN#0]  3.94,20.32 0 top
U$68  [#D0#1]  5.08,35.56 0 bottom
U$69  [#CIPO#2]  6.73,38.1 0 bottom
U$70  [#CIPO#2]  1.78,38.1 0 top
U$71  [#COPI#1]  1.91,40.64 0 top
U$72  [#COPI#1]  6.86,40.64 0 bottom
U$73  [#GND#4]  1.78,33.02 0 top
U$74  [#GND#4]  6.22,33.02 0 bottom
U$75  [#VIN#0]  3.94,20.32 0 bottom
U$76  [#3#3V#0]  4.32,17.78 0 top
U$77  [#SCK#0]  1.91,43.18 0 top
U$78  [#SCK#0]  6.1,43.18 0 bottom
U$79  [#3#3V#0]  4.32,17.78 0 bottom
U$80  [#VCCIO#0]  4.95,15.24 0 top
U$81  [#GND#4]  1.78,10.16 0 top
U$82  [#GND#4]  6.22,10.16 0 bottom
U$83  [#VCCIO#0]  4.95,15.24 0 bottom
U$84  [#1#8V#0]  4.19,12.7 0 top
U$85  [#1#8V#0]  4.19,12.7 0 bottom
U$86  [#RST#1]  6.1,7.62 0 bottom
U$87  [#MEAS#2]  26.42,16.38 0 bottom
U$88  [LTE0]  9.02,74.8 0 top
U$89  [LTE0]  8.89,74.8 0 bottom
U$90  [NI0]  5.71,51.44 0 top
U$91  [TP0]  5.71,49.53 0 top
U$92  [#USB_D##0]  20.45,48.13 270 bottom
U$93  [#USB_D##0]  18.54,45.97 270 bottom
U$94  [#V_USB#0]  16.51,48.39 270 bottom
U$95  [AG0]  63.5,25.4 0 top
U$96  [M0]  62.48,31.75 0 top
U$97  [CHARGE0]  45.85,1.14 0 top
U$98  [ASSET_TRACKER0]  38.1,59.69 0 bottom
U$99  [GNSS0]  67.82,74.8 0 top
U$100  [GNSS0]  67.69,74.8 0 bottom
U$101  [ON0]  5.84,53.34 0 top
U$102  [#DSR#0]  27.18,52.96 0 bottom
U$103  [#SARA_INT#0]  17.21,41.91 0 bottom
U$104  [#RI#0]  28.83,36.07 0 bottom
U$105  [#DSR#0]  19.3,37.97 0 bottom
U$106  [#SD_#CS##0]  27.56,27.94 0 bottom
U$107  [#IMU_PWR#0]  26.42,34.04 0 bottom
U$108  [#LTE_PWR#0]  26.29,32 0 bottom
U$109  [#SD_PWR#0]  26.8,29.97 0 bottom
U$110  [#SARA_#ON##0]  17.4,40.01 0 bottom
U$111  [#SARA_SCL#0]  56.52,48.26 270 bottom
U$112  [#SARA_SDA#0]  53.47,48.13 270 bottom
U$113  [SARA_ON0]  16.51,22.35 0 top
U$114  [#CIPO#0]  46.23,41.27 0 bottom
U$115  [22220]  49.53,21.59 0 top
U$116  [#PDM_CLK#0]  62.87,35.43 270 bottom
U$117  [#PDM_DAT#0]  56.52,35.18 270 bottom
U$118  [#EXT_INT#0]  50.23,66.1 270 bottom
U$119  [#GPIO3#0]  52.07,66.93 270 bottom
U$122  [#G0#0]  33.66,27.94 0 bottom
U$123  [#G1#0]  33.53,29.97 0 bottom
U$124  [#G2#0]  33.66,32 0 bottom
U$125  [#G3#0]  33.66,34.04 0 bottom
U$126  [#G4#0]  33.66,36.07 0 bottom
U$127  [#G7#0]  24.64,37.97 0 bottom
U$128  [#G6#0]  24.64,40.01 0 bottom
U$129  [#G5#0]  24.57,41.91 0 bottom
U$130  [NANO0]  71.12,67.31 0 top
U$131  [SIM0]  71.12,66.04 0 top
U$133  [#VIN#3#0]  14.48,14.7 270 bottom
U$134  [#ICM_INT#0]  43.5,29.65 0 bottom
VE  [SMT-JUMPER_2_NO_SILK]  36.7,20.83 180 bottom
VIN/3  JUMPER-SMT_2_NC_TRACE_SILK  [SMT-JUMPER_2_NC_TRACE_SILK]  16.48,14.64 270 bottom
VIN_LED  [SMT-JUMPER_2_NC_TRACE_SILK]  8.89,45.72 0 bottom